# EAGLE schematic sta013-breakout (EAGLE 5.10)
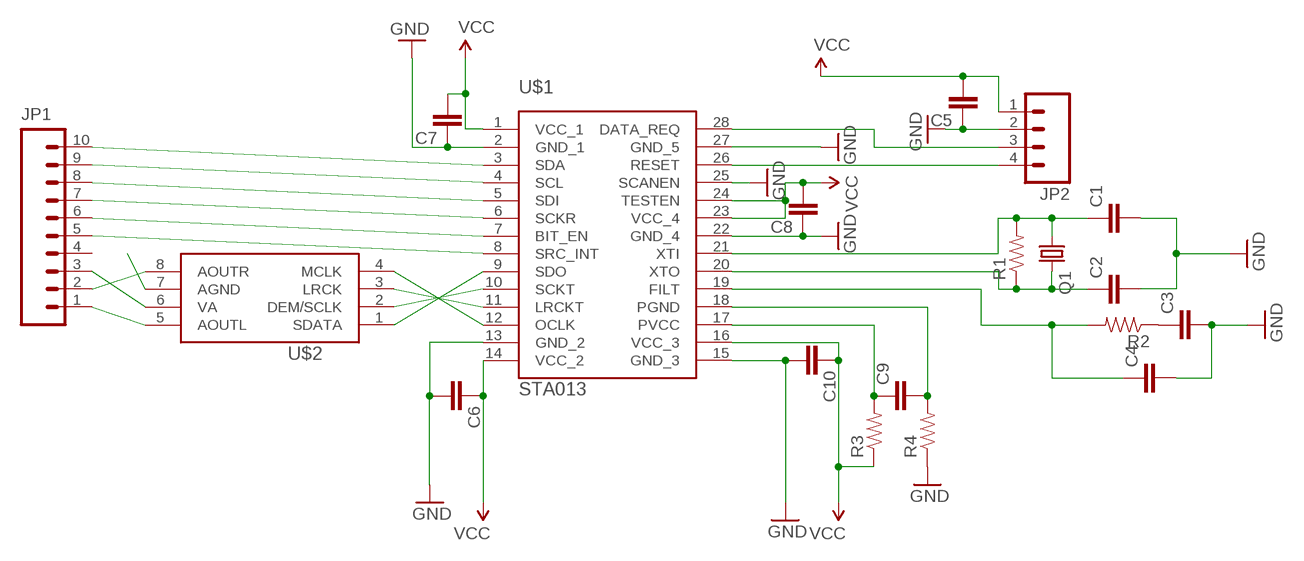
[diagram p0: schematic, sheet 1]

## Parts
C1  CAP_  [AXIAL-5MM]
C2  CAP_  [AXIAL-5MM]
C3  CAP_  [AXIAL-5MM]
C4  CAP_  [AXIAL-5MM]
C5  CAP_  [AXIAL-5MM]
C6  CAP_  [AXIAL-5MM]
C7  CAP_  [AXIAL-5MM]
C8  CAP_  [AXIAL-5MM]
C9  CAP_  [AXIAL-5MM]
C10  CAP_  [AXIAL-5MM]
JP1  M10LOCK_LONGPADS  [1X10_LOCK_LONGPADS]
JP2  M04LOCK_LONGPADS  [1X04_LOCK_LONGPADS]
Q1  CRYSTALHC49US  [HC49US]
R1  RESISTORPTH1  [AXIAL-0.3]
R2  RESISTORPTH1  [AXIAL-0.3]
R3  RESISTORPTH1  [AXIAL-0.3]
R4  RESISTORPTH1  [AXIAL-0.3]
U$1  STA013  [SO28W]
U$2  CS4334  [SO08]

## Nets
GND: C1.P$2 C2.P$2 C3.P$2 C4.P$2 C5.P$1 C6.P$2 C7.P$1 C8.P$1 C10.P$2 JP2.2 R4.P$1 U$1.2(GND_1) U$1.13(GND_2) U$1.15(GND_3) U$1.22(GND_4) U$1.25(SCANEN) U$1.27(GND_5) U$2.7(AGND)
N$1: C1.P$1 Q1.1 R1.P$2 U$1.21(XTI)
N$2: C2.P$1 Q1.2 R1.P$1 U$1.20(XTO)
N$3: JP1.10 U$1.3(SDA)
N$4: C4.P$1 R2.P$2 U$1.19(FILT)
N$5: C3.P$1 R2.P$1
N$6: C9.P$1 R3.P$2 U$1.17(PVCC)
N$7: C9.P$2 R4.P$2 U$1.18(PGND)
N$8: JP1.9 U$1.4(SCL)
N$9: JP1.8 U$1.5(SDI)
N$10: JP1.7 U$1.6(SCKR)
N$11: JP1.6 U$1.7(BIT_EN)
N$12: JP1.5 U$1.8(SRC_INT)
N$13: JP1.1 U$2.5(AOUTL)
N$14: JP1.2 U$2.8(AOUTR)
N$15: JP1.3 U$2.6(VA)
N$16: U$1.9(SDO) U$2.1(SDATA)
N$17: JP2.4 U$1.26(RESET)
N$18: JP2.3 U$1.28(DATA_REQ)
N$19: U$1.10(SCKT) U$2.2(DEM/SCLK)
N$20: U$1.11(LRCKT) U$2.3(LRCK)
N$21: U$1.12(OCLK) U$2.4(MCLK)
VCC: C5.P$2 C6.P$1 C7.P$2 C8.P$2 C10.P$1 JP2.1 R3.P$1 U$1.1(VCC_1) U$1.14(VCC_2) U$1.16(VCC_3) U$1.23(VCC_4) U$1.24(TESTEN)
Unconnected: JP1.4

## Library data of the parts
C1-C10 = SparkFun:CAP: Capacitor Standard 0603 ceramic capacitor, and 0.1" leaded capacitor.
JP1 = SparkFun:M10: Header 10 Standard 10-pin 0.1" header. Use with straight break away headers (SKU : PRT-00116), right angle break away headers (PRT-00553), swiss pins (PRT-00743), machine pins (PRT-00117), and female headers (PRT-00115).
JP2 = SparkFun:M04: Header 4 Standard 4-pin 0.1" header. Use with straight break away headers (SKU : PRT-00116), right angle break away headers (PRT-00553), swiss pins (PRT-00743), machine pins (PRT-00117), and female headers (PRT-00115). Molex polarized connector foot print use with SKU : PRT-08231 with associated crimp pins and housings.
Q1 = ideabot:CRYSTAL: Crystals Various standard crystals. Proven footprints. Spark Fun Electronics SKU : COM-00534
R1-R4 = SparkFun:RESISTOR: Resistor Basic schematic elements and footprints for 0603, 1206, and PTH 1/10th watt (small) resistors.
U$1 = ideabot:STA013
U$2 = ideabot:CS4334: CS4334 DAC produced by Cirrus Logic